# EAGLE design shield (EAGLE 6.4)
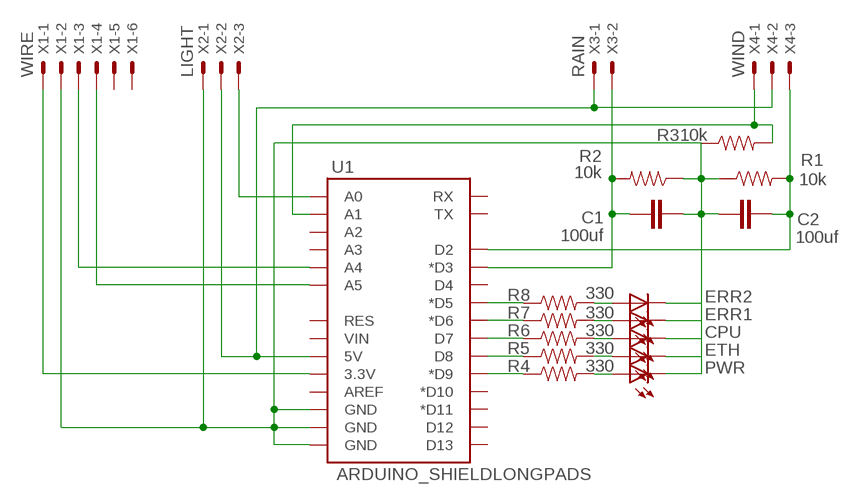
[diagram p0: schematic, sheet 1]

## Parts
C1  100uf  CAPKIT  [CAP-PTH-SMALL-KIT]
C2  100uf  CAPKIT  [CAP-PTH-SMALL-KIT]
CPU  LED3MM  [LED3MM]
ERR1  LED3MM  [LED3MM]
ERR2  LED3MM  [LED3MM]
ETH  LED3MM  [LED3MM]
PWR  LED3MM  [LED3MM]
R1  10k  RESISTORKIT  [AXIAL-0.3-KIT]
R2  10k  RESISTORKIT  [AXIAL-0.3-KIT]
R3  10k  RESISTORKIT  [AXIAL-0.3-KIT]
R4  330  RESISTORKIT  [AXIAL-0.3-KIT]
R5  330  RESISTORKIT  [AXIAL-0.3-KIT]
R6  330  RESISTORKIT  [AXIAL-0.3-KIT]
R7  330  RESISTORKIT  [AXIAL-0.3-KIT]
R8  330  RESISTORKIT  [AXIAL-0.3-KIT]
U1  ARDUINO_SHIELDLONGPADS  [DUEMILANOVE_SHIELD_LONGPADS]
X1  WIRE  22-23-2061  [22-23-2061]
X2  LIGHT  22-23-2031  [22-23-2031]
X3  RAIN  22-23-2021  [22-23-2021]
X4  WIND  22-23-2031  [22-23-2031]

## Nets
GND: C1.2 C2.1 CPU.K(C) ERR1.K(C) ERR2.K(C) ETH.K(C) PWR.K(C) R1.P$1 R2.P$1 R3.P$1 U1.GND@0(GND) U1.GND@1(GND) U1.GND@2(GND) X1.2 X2.1
INT0: C2.2 R1.P$2 U1.D2 X4.3
INT1: C1.1 R2.P$2 U1.D3(*D3) X3.2
N$1: U1.3.3V X1.1
N$2: R8.P$1 U1.D5(*D5)
N$3: U1.5V X2.2 X3.1 X4.2
N$4: U1.A0 X2.3
N$5: R3.P$2 U1.A1 X4.1
N$6: R7.P$1 U1.D6(*D6)
N$7: R6.P$1 U1.D7
N$8: ERR2.A R8.P$2
N$9: R5.P$1 U1.D8
N$10: ERR1.A R7.P$2
N$11: CPU.A R6.P$2
N$12: ETH.A R5.P$2
N$13: PWR.A R4.P$2
N$14: R4.P$1 U1.D9(*D9)
SCL: U1.A5 X1.4
SDA: U1.A4 X1.3
Unconnected: U1.A2 U1.A3 U1.AREF U1.D4 U1.D10(*D10) U1.D11(*D11) U1.D12 U1.D13 U1.RES U1.RX U1.TX U1.VIN X1.5 X1.6

## Library data of the parts
C1 C2 = SparkFun:CAP: Capacitor Standard 0603 ceramic capacitor, and 0.1" leaded capacitor.
CPU ERR1 ERR2 ETH PWR = SparkFun:LED: LEDs Standard schematic elements and footprints for 5mm, 3mm, 1206, and 0603 sized LEDs. 5mm - Spark Fun Electronics SKU : COM-00529 (and others)
R1-R8 = SparkFun:RESISTOR: Resistor Basic schematic elements and footprints for 0603, 1206, and PTH resistors.
U1 = SparkFun:ARDUINO_SHIELD
X1 = con-molex:22-23-2061: .100" (2.54mm) Center Header - 6 Pin; MF: MOLEX; MPN: 22-23-2061; OC_FARNELL: 1462922; OC_NEWARK: 27C1933
X2 X4 = con-molex:22-23-2031: .100" (2.54mm) Center Header - 3 Pin; MF: MOLEX; MPN: 22-23-2031; OC_FARNELL: 1462950; OC_NEWARK: 30C0862
X3 = con-molex:22-23-2021: .100" (2.54mm) Center Header - 2 Pin; MF: MOLEX; MPN: 22-23-2021; OC_FARNELL: 1462926; OC_NEWARK: 25C3832

## Board
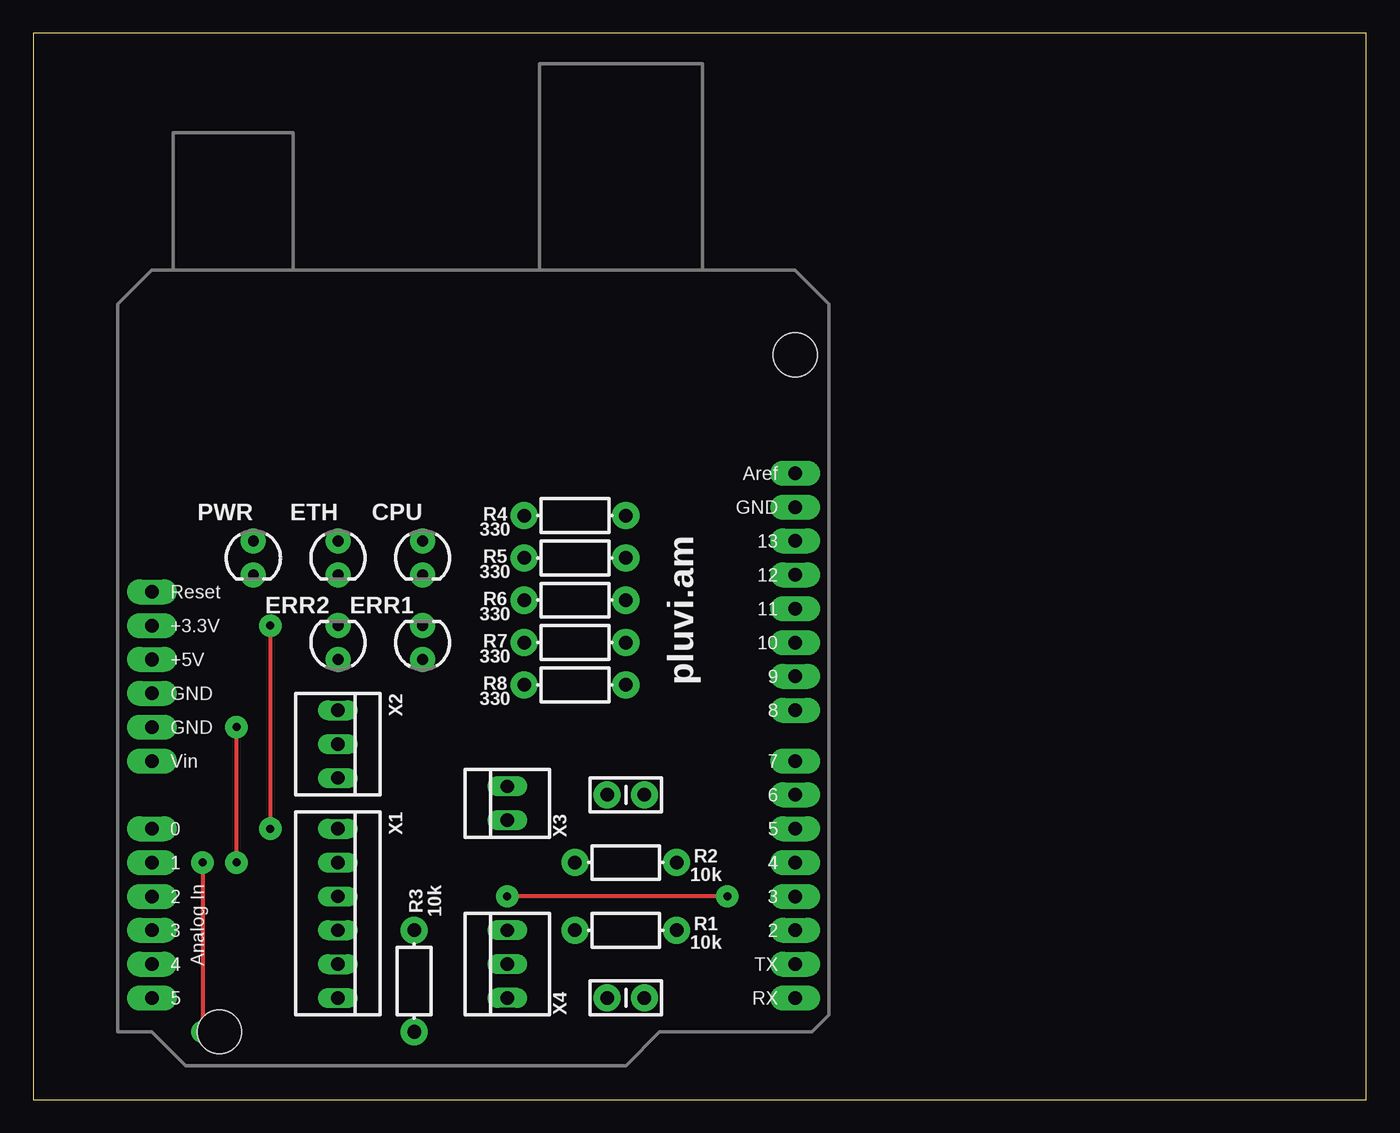
[diagram p1: board, top side]
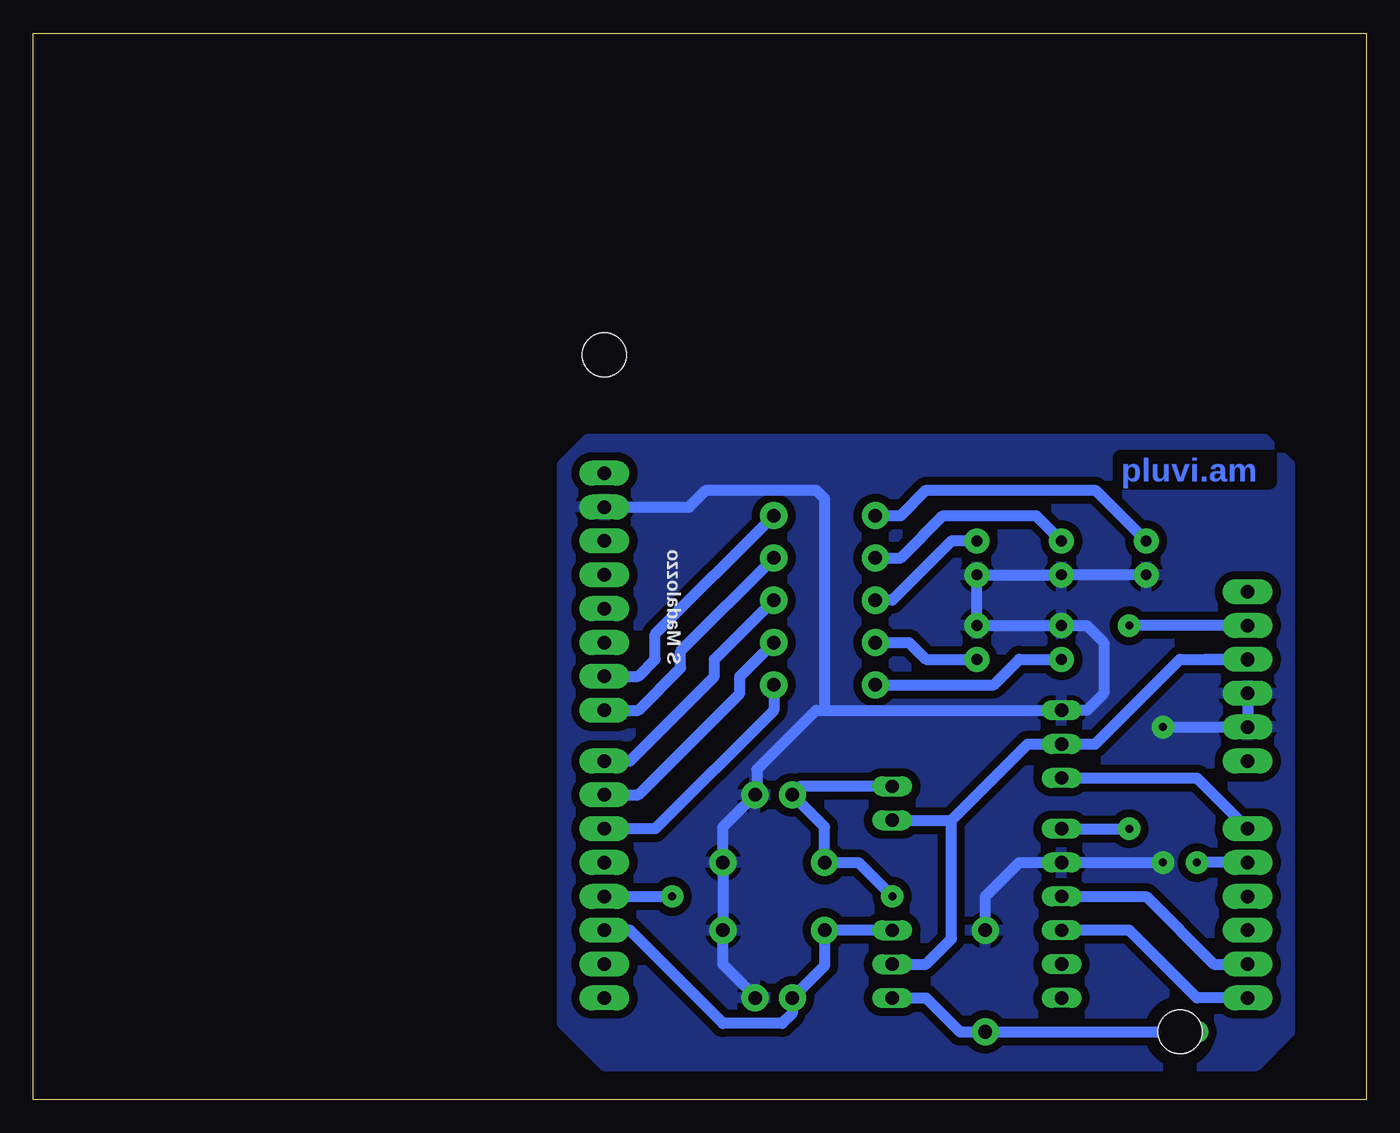
[diagram p2: board, bottom side, seen from below]

Size 100 x 80 mm. Coordinates in mm from the lower left corner, seen from the top.
Outline: 0,0 100,0 100,80 0,80 0,0
Copper layers (1*16): Top 0.035mm / dielectric 1.5mm / Bottom 0.035mm
Design rules "default *": minimum track width 10mil, minimum drill 24mil, track to track 8mil, track to pad 8mil, pad to pad 8mil, via to via 8mil, smd to smd 8mil, copper to edge 40mil, drill to drill 8mil, minimum pad ring 10mil, minimum via ring 8mil, stop-mask expansion 4mil, vias tented up to drill 0mil, thermal gap 15mil

### Footprints (pad centres in the part's own frame; a part is rotated, then mirrored left to right if it is on the bottom)
CAP-PTH-SMALL-KIT = drill 1.016 pad 2.032: 1 -1.397,0; 2 1.397,0
LED3MM = drill 0.813 pad 1.88: A -1.27,0; K 1.27,0
AXIAL-0.3-KIT = drill 1.016 pad 2.032: P$1 -3.81,0; P$2 3.81,0
DUEMILANOVE_SHIELD_LONGPADS = drill 1.016 pad 1.88 long: 3.3V 50.8,26.67; 5V 50.8,29.21; A0 50.8,41.91; A1 50.8,44.45; A2 50.8,46.99; A3 50.8,49.53; A4 50.8,52.07; A5 50.8,54.61; AREF 2.54,15.24; D2 2.54,49.53; D3 2.54,46.99; D4 2.54,44.45; D5 2.54,41.91; D6 2.54,39.37; D7 2.54,36.83; D8 2.54,33.02; D9 2.54,30.48; D10 2.54,27.94; D11 2.54,25.4; D12 2.54,22.86; D13 2.54,20.32; GND@0 50.8,31.75; GND@1 50.8,34.29; GND@2 2.54,17.78; RES 50.8,24.13; RX 2.54,54.61; TX 2.54,52.07; VIN 50.8,36.83 | hole 3.302: 45.72,57.15; 2.54,6.35
22-23-2061 = drill 1 long: 1 -6.35,0; 2 -3.81,0; 3 -1.27,0; 4 1.27,0; 5 3.81,0; 6 6.35,0
22-23-2031 = drill 1 long: 1 -2.54,0; 2 0,0; 3 2.54,0
22-23-2021 = drill 1 long: 1 -1.27,0; 2 1.27,0

### Placement (x,y rotation side)
C1  44.45,22.86 0 top
C2  44.45,7.62 180 top
CPU  29.21,40.64 270 top
ERR1  29.21,34.29 90 top
ERR2  22.86,34.29 90 top
ETH  22.86,40.64 270 top
PWR  16.51,40.64 270 top
R1  44.45,12.7 180 top
R2  44.45,17.78 180 top
R3  28.57,8.89 270 top
R4  40.64,43.81 180 top
R5  40.64,40.64 180 top
R6  40.64,37.47 180 top
R7  40.64,34.29 180 top
R8  40.64,31.11 180 top
U1  59.69,62.23 180 top
X1  22.86,13.97 270 top
X2  22.86,26.67 270 top
X3  35.56,22.23 90 top
X4  35.56,10.16 90 top

### Tracks (layer width: path | path; a pad name or v marks a point on that pad's centre or on a via)
GND  (via drill 0.6 pad 1.68)
  Top 0.305: v15.24,17.78 v15.24,27.94
  Bottom 0.813: PWR.K ETH.K CPU.K ERR1.K ERR2.K 20.95,35.56 19.68,34.29 19.68,30.48 20.95,29.21 X2.1 40.64,29.21 | U1.GND@0 U1.GND@1 v15.24,27.94 | C2.1 45.85,7.75 48.26,10.16 R1.P$1 R2.P$1 48.26,20.45 C1.2 45.72,22.99 45.72,24.77 41.27,29.21 40.64,29.21 | U1.GND@2 50.8,44.45 49.53,45.72 41.27,45.72 40.64,45.09 40.64,29.21 | v15.24,17.78 X1.2 26.04,17.78 28.57,15.24 R3.P$1
  pour Bottom (isolate 0.61): 5.71,47.62 7.62,49.53 58.42,49.53 60.33,47.62 60.33,5.71 57.15,2.54 8.26,2.54 5.71,5.08
INT0
  Bottom 0.813: X4.3 R1.P$2 40.64,10.03 C2.2 43.05,6.48 43.81,5.71 48.26,5.71 55.24,12.7 U1.D2
INT1  (via drill 0.6, 0.6 pad 1.68)
  Top 0.305: v52.07,15.24 v35.56,15.24
  Bottom 0.813: U1.D3 v52.07,15.24 | X3.2 42.42,23.5 C1.1 40.64,20.45 R2.P$2 38.1,17.78 v35.56,15.24
N$1  (via drill 0.6, 0.6 pad 1.68)
  Top 0.305: v17.78,35.56 v17.78,20.32
  Bottom 0.813: U1.3.3V v17.78,35.56 | X1.1 v17.78,20.32
N$2
  Bottom 0.813: R8.P$1 44.45,29.21 53.34,20.32 U1.D5
N$3
  Bottom 0.813: 12.06,33.02 U1.5V 13.97,33.02 20.32,26.67 X2.2 25.4,26.67 31.11,20.95 | X3.1 31.11,20.95 | X4.2 33.02,10.16 31.11,12.06 31.11,20.95
N$4
  Bottom 0.813: X2.3 12.7,24.13 U1.A0
N$5  (via drill 0.6, 0.6 pad 1.68)
  Top 0.305: v12.7,17.78 v12.7,5.08
  Bottom 0.813: U1.A1 v12.7,17.78 | v12.7,5.08 R3.P$2 30.48,5.08 33.02,7.62 X4.1
N$6
  Bottom 0.813: U1.D6 54.61,22.86 46.99,30.48 46.99,31.75 R7.P$1
N$7
  Bottom 0.813: U1.D7 55.24,25.4 48.9,31.75 48.9,33.02 R6.P$1
N$8
  Bottom 0.813: ERR2.A 26.04,33.02 27.94,31.11 R8.P$2
N$9
  Bottom 0.813: U1.D8 54.61,29.21 51.44,32.38 51.44,33.66 R5.P$1
N$10
  Bottom 0.813: R7.P$2 34.29,34.29 33.02,33.02 ERR1.A
N$11
  Bottom 0.813: CPU.A 31.11,41.91 35.56,37.47 R6.P$2
N$12
  Bottom 0.813: R5.P$2 34.92,40.64 31.75,43.81 24.77,43.81 ETH.A
N$13
  Bottom 0.813: R4.P$2 34.92,43.81 33.02,45.72 20.32,45.72 PWR.A
N$14
  Bottom 0.813: U1.D9 54.61,31.75 53.34,33.02 53.34,34.92 R4.P$1
SCL
  Bottom 0.813: U1.A5 12.7,7.62 17.78,12.7 X1.4
SDA
  Bottom 0.813: X1.3 16.51,15.24 11.43,10.16 U1.A4

### Text on the board
Bottom: pluvi.am
tPlace: pluvi.am
bPlace: S Madalozzo